# Altium schematic sheet SegmentDriver.SchDoc: LiveDesign Evaluation - Countdown
size A4; Organization: Altium Limited; Address1: L3, 12a Rodborough Rd; Address2: Frenchs Forest; Address3: NSW; Address4: Australia 2086; DocumentNumber: 4; SheetNumber: 4; SheetTotal: 4
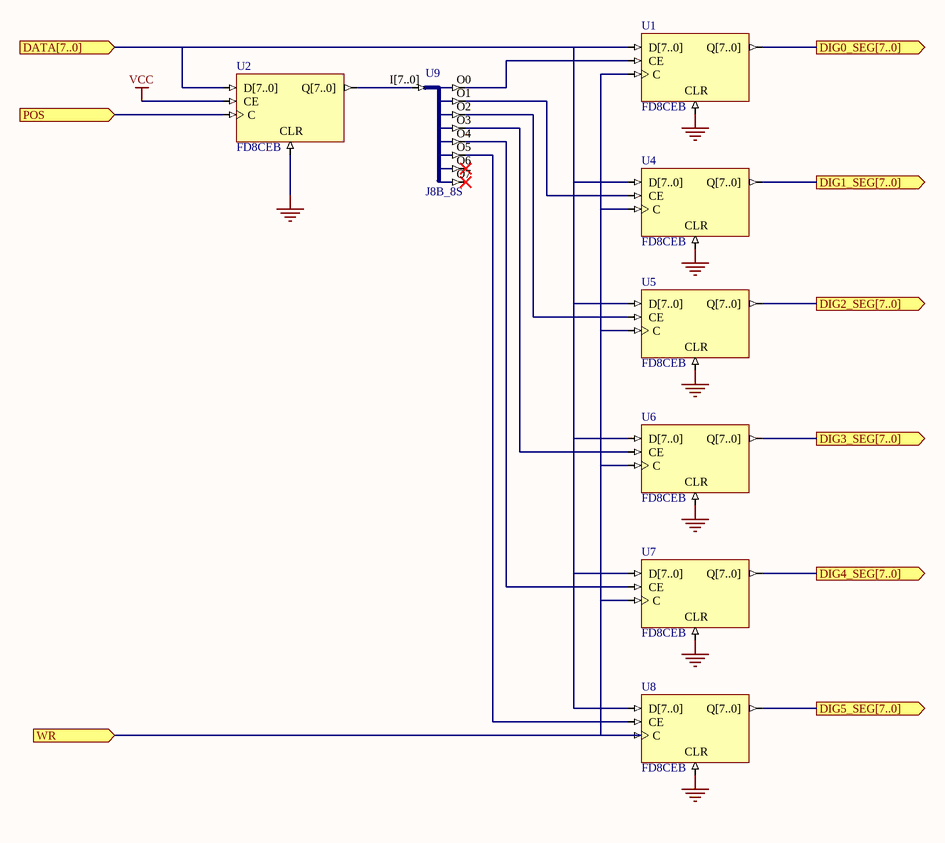
[diagram p0: SegmentDriver.SchDoc]

## Parts
U1  FD8CEB
U2  FD8CEB
U4  FD8CEB
U5  FD8CEB
U6  FD8CEB
U7  FD8CEB
U8  FD8CEB
U9  J8B_8S

## Ports
DATA[7..0] (in), DIG0_SEG[7..0] (out), DIG1_SEG[7..0] (out), DIG2_SEG[7..0] (out), DIG3_SEG[7..0] (out), DIG4_SEG[7..0] (out), DIG5_SEG[7..0] (out), POS (in), WR (in)

## Nets
GND: U1.CLR U2.CLR U4.CLR U5.CLR U6.CLR U7.CLR U8.CLR
VCC: U2.CE
DATA[7..0]: U1.D[7..0] U2.D[7..0] U4.D[7..0] U5.D[7..0] U6.D[7..0] U7.D[7..0] U8.D[7..0] ; port DATA[7..0]
DIG0_SEG[7..0]: U1.Q[7..0] ; port DIG0_SEG[7..0]
DIG1_SEG[7..0]: U4.Q[7..0] ; port DIG1_SEG[7..0]
DIG2_SEG[7..0]: U5.Q[7..0] ; port DIG2_SEG[7..0]
DIG3_SEG[7..0]: U6.Q[7..0] ; port DIG3_SEG[7..0]
DIG4_SEG[7..0]: U7.Q[7..0] ; port DIG4_SEG[7..0]
DIG5_SEG[7..0]: U8.Q[7..0] ; port DIG5_SEG[7..0]
POS: U2.C ; port POS
WR: U1.C U4.C U5.C U6.C U7.C U8.C ; port WR
NetU1_CE: U1.CE U9.O0
NetU2_Q[7..0]: U2.Q[7..0] U9.I[7..0]
NetU4_CE: U4.CE U9.O1
NetU5_CE: U5.CE U9.O2
NetU6_CE: U6.CE U9.O3
NetU7_CE: U7.CE U9.O4
NetU8_CE: U8.CE U9.O5

Not connected (* = marked no-connect by the designer): U9 O6* O7*

## Notes on the sheet
- Title
- Size:
- Date:
- A4
- Number:
- Time:
- Revision:
- Sheet
- of
- File:

## Library data of the parts
U1 U2 U4-U8 = FD8CEB: 8-Bit D-Type Flip-Flop with Clock Enable and Asynchronous Clear, Bus Version; XilinxEquivalent: FD8CE; SubClass: FD; ClockTrigger: Rising; Enable: High; PortSize: 8; ArchiveName: GENERIC; VHDLIB_SIM: GENERIC_LIB; Published: 29-Jan-2004; Publisher: Altium Limited; LastRevisionNo: 1.00.00; HelpURL: CR0118 FPGA Generic Library Guide.pdf#page=173; FunctionalClass: Flip-Flop; Reset: Asynchronous; PortStyle: Bus Version
U9 = J8B_8S: 8-Bit input bus to 8 single pin outputs; FunctionalClass: Bus Joiner; PortSize: 8; ArchiveName: GENERIC; VHDLIB_SIM: GENERIC_LIB; Published: 29-Jan-2004; Publisher: Altium Limited; LastRevisionNo: 1.00.00; HelpURL: CR0118 FPGA Generic Library Guide.pdf#page=303